# Altium schematic sheet MCU_F401RE.SchDoc
size A4; DocumentNumber: 4; SheetNumber: 4; SheetTotal: 5
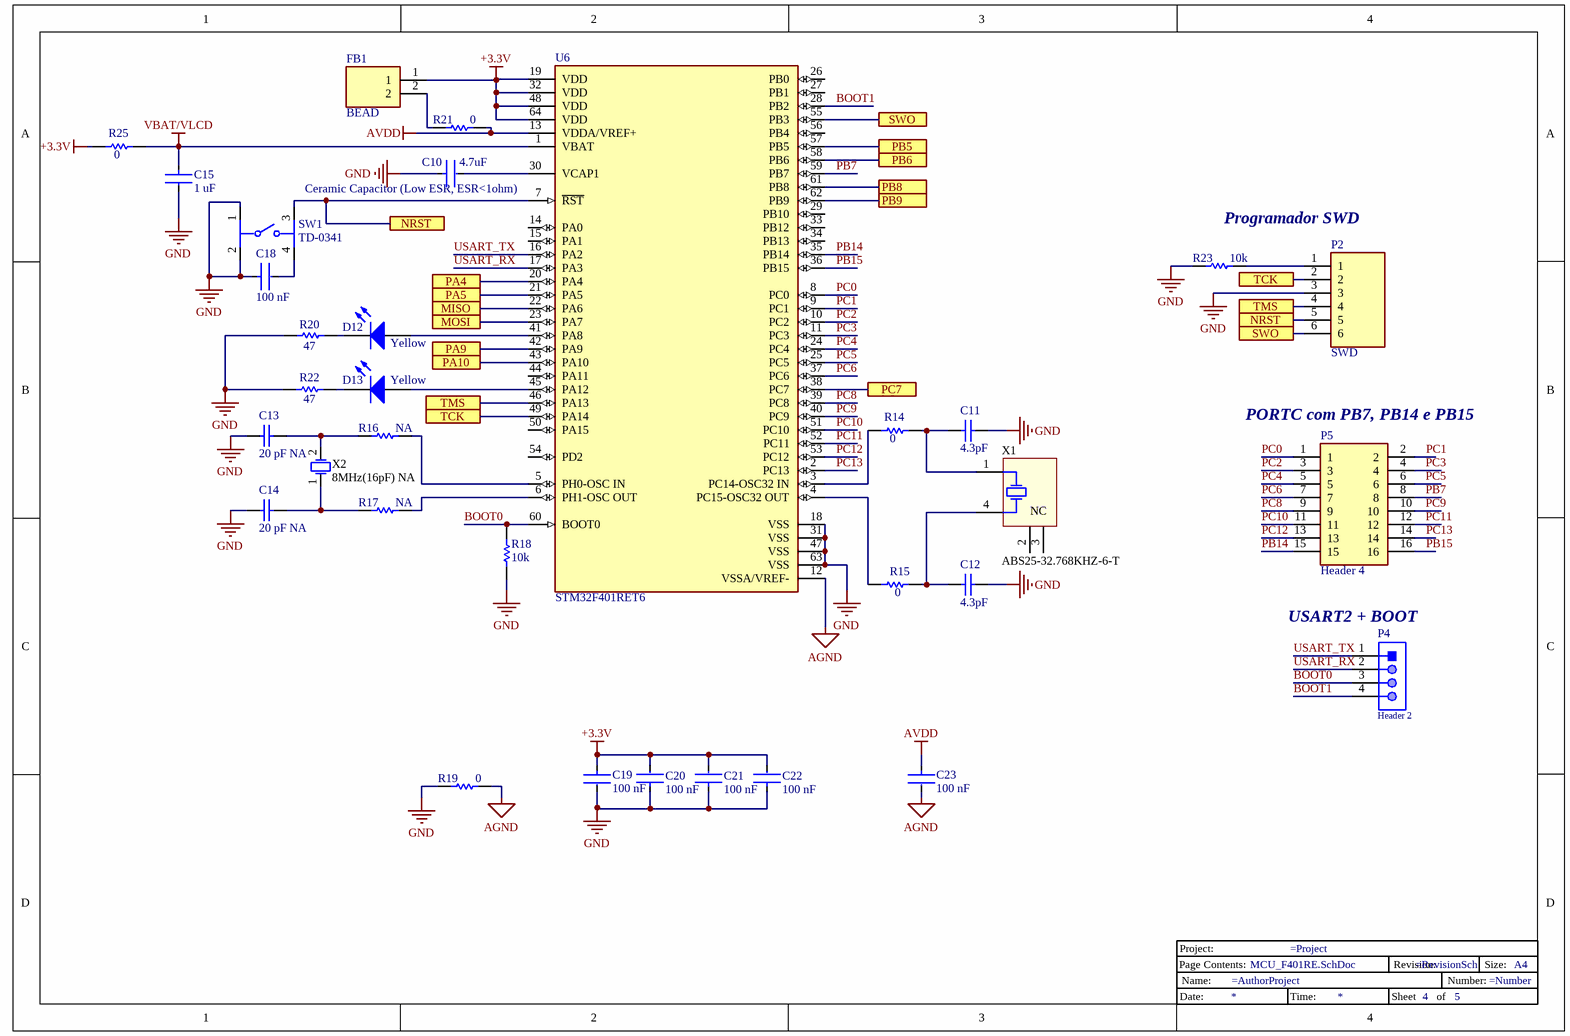
[diagram p0: MCU_F401RE.SchDoc]

## Parts
C10  4.7uF  [FP-GRT21B-0_15-IPC_B]
C11  4.3pF  [CAPC1608X90X35LL10T15]
C12  4.3pF  [CAPC1608X90X35LL10T15]
C13  20 pF NA  [CAPC1608X90X35NL15T15]
C14  20 pF NA  [CAPC1608X90X35NL15T15]
C15  1 uF  [FP-CC0603-DA-MFG]
C18  100 nF  [FP-CC0603-DA-MFG]
C19  100 nF  [FP-CC0603-DA-MFG]
C20  100 nF  [FP-CC0603-DA-MFG]
C21  100 nF  [FP-CC0603-DA-MFG]
C22  100 nF  [FP-CC0603-DA-MFG]
C23  100 nF  [FP-CC0603-DA-MFG]
D12  Yellow  [0805_A]
D13  Yellow  [0805_A]
FB1  BEAD  [BEADC1608X95N]
P2  SWD  [HDRV6W30P0X127_1X6_762X210X430P]
P4  Header 2  [61300411121]
P5  Header 4  [HDRV16W67P254_2X8_1991X488X821P]
R14  0  [RESC1608X55X25ML10T15]
R15  0  [RESC1608X55X25ML10T15]
R16  NA  [RESC1608X55X25ML10T15]
R17  NA  [RESC1608X55X25ML10T15]
R18  10k  [RESC1608X55X25ML10T15]
R19  0  [RESC1608X55X25ML10T15]
R20  47  [RESC1608X55X30NL20T20]
R21  0  [RESC1608X55X25ML10T15]
R22  47  [RESC1608X55X30NL20T20]
R23  10k  [RESC1608X55X25ML10T15]
R25  0  [RESC1608X55X25ML10T15]
SW1  TD-0341  [FP-1571563-9-MFG]
Title_Block_4  Title_Block  (value not drawn)
U6  STM32F401RET6  [FP-LQFP64-5W-MFG]
X1  ABS25-32.768KHZ-6-T  [ABRA-ABS25-4_V]
X2  8MHz(16pF) NA  [FOX-FOXSLF160-20]

## Ports
MISO, MOSI, NRST, PA4, PA5, PA9, PA10, PB5, PB6, PB8, PB9, PC7, SWO, TCK, TMS

## Nets
+3.3V: C19.1 C20.2 C21.2 C22.2 FB1.1 R25.1 U6.19(VDD) U6.32(VDD) U6.48(VDD) U6.64(VDD)
AGND: C23.2 R19.2 U6.12(VSSA/VREF-)
AVDD: C23.1 R21.2 U6.13(VDDA/VREF+)
GND: C10.1 C11.2 C12.2 C13.1 C14.1 C15.2 C18.1 C19.2 C20.1 C21.1 C22.1 P2.3 R18.1 R19.1 R20.2 R22.2 R23.1 SW1.1 SW1.2 U6.18(VSS) U6.31(VSS) U6.47(VSS) U6.63(VSS)
VBAT/VLCD: C15.1 R25.2 U6.1(VBAT)
BOOT0: P4.3 R18.2 U6.60(BOOT0)
BOOT1: P4.4 U6.28(PB2)
MISO: U6.22(PA6) ; port MISO
MOSI: U6.23(PA7) ; port MOSI
NRST: P2.5 SW1.3 U6.7(~{RST}) ; port NRST
PA4: U6.20(PA4) ; port PA4
PA5: U6.21(PA5) ; port PA5
PA9: U6.42(PA9) ; port PA9
PA10: U6.43(PA10) ; port PA10
PB5: U6.57(PB5) ; port PB5
PB6: U6.58(PB6) ; port PB6
PB7: P5.8 U6.59(PB7)
PB8: U6.61(PB8) ; port PB8
PB9: U6.62(PB9) ; port PB9
PB14: P5.15 U6.35(PB14)
PB15: P5.16 U6.36(PB15)
PC0: P5.1 U6.8(PC0)
PC1: P5.2 U6.9(PC1)
PC2: P5.3 U6.10(PC2)
PC3: P5.4 U6.11(PC3)
PC4: P5.5 U6.24(PC4)
PC5: P5.6 U6.25(PC5)
PC6: P5.7 U6.37(PC6)
PC7: U6.38(PC7) ; port PC7
PC8: P5.9 U6.39(PC8)
PC9: P5.10 U6.40(PC9)
PC10: P5.11 U6.51(PC10)
PC11: P5.12 U6.52(PC11)
PC12: P5.13 U6.53(PC12)
PC13: P5.14 U6.2(PC13)
SWO: P2.6 U6.55(PB3) ; port SWO
TCK: P2.2 U6.49(PA14) ; port TCK
TMS: P2.4 U6.46(PA13) ; port TMS
USART_RX: P4.2 U6.17(PA3)
USART_TX: P4.1 U6.16(PA2)
NetC10_2: C10.2 U6.30(VCAP1)
NetC11_1: C11.1 R14.2 X1.1(X1)
NetC12_1: C12.1 R15.2 X1.4(X2)
NetC13_2: C13.2 R16.1 X2.2
NetC14_2: C14.2 R17.1 X2.1
NetC18_2: C18.2 SW1.4
NetD12_1: D12.1(K) R20.1
NetD12_2: D12.2(A) U6.41(PA8)
NetD13_1: D13.1(K) R22.1
NetD13_2: D13.2(A) U6.45(PA12)
NetFB1_2: FB1.2 R21.1
NetP2_1: P2.1 R23.2
NetR14_1: R14.1 U6.3(PC14-OSC32_IN)
NetR15_1: R15.1 U6.4(PC15-OSC32_OUT)
NetR16_2: R16.2 U6.5(PH0-OSC_IN)
NetR17_2: R17.2 U6.6(PH1-OSC_OUT)

Not connected (* = marked no-connect by the designer): U6 14(PA0) 15(PA1) 26(PB0) 27(PB1) 29(PB10) 33(PB12) 34(PB13) 44(PA11) 50(PA15) 54(PD2) 56(PB4); X1 2(NC) 3(NC)

## Notes on the sheet
- (near C10) Ceramic Capacitor (Low ESR, ESR<1ohm)
- Programador SWD
- (near P5) PORTC com PB7, PB14 e PB15
- (near P4) USART2 + BOOT
- (in symbol Title_Block) Project:; Page Contents:; Revision:; Size:; A4; Name:; Number:; Date:; Time:; Sheet; of

## Library data of the parts
C10 = CMP-06035-019733-1: Cap Ceramic 4.7uF 50V X5R ±10% SMD 0805 +85°C Emboss T/R; Voltage Rating: 50V; Mount: Surface Mount; Ratings: AEC-Q200; Packaging: Tape and Reel; Width: 0.049inch; Case/Package: 0805; Max Operating Temperature: 85°C; Length: 0.079inch; Case Code (Imperial): 0805; Capacitance: 4.7uF; Thickness: 0.057inch; Min Operating Temperature: -55°C; Case Code (Metric): 2012; Dielectric: X5R; Tolerance: 10%; Voltage Rating (DC): 50V
C11 C12 = CMP-2006-02448-1: 0603; Part Number: GQM1885C2A4R3BB01D; Manufacturer: Murata
C13 C14 = CMP-2006-04264-1: Part Number: 06035A200JAT2A; Manufacturer: AVX Interconnect / Elco
C15 = CMP-1035-02737-2: CAP CER 1UF 16V X5R 0603; Manufacturer Part Number: CC0603KRX5R7BB105; Manufacturer: YAGEO; Material: Ceramic; Temperature Coefficient: 15%; Tolerance: 0.1; Digikey Description: CAP CER 1UF 16V X5R 0603; Category: Cap; Automotive: No; Octopart: https://octopart.com/cc0603krx5r7bb105-yageo-8376530; Voltage Rating: 16 V; Device Class L3: Ceramic Capacitors; Value: 1 uF; Temperature Characteristic: X5R; Voltage: 16 V; RoHS: TRUE; Lead Free: Yes; Temperature: -55°C to +125°C; Device Class L2: Capacitors; ComponentLink2URL: http://www.yageo.com/documents/recent/UPY-GPHC_X7R_6.3V-to-50V_18.pdf; Capacitance: 1 uF; Footprint Url: http://www.yageo.com/exep/pages/download/literatures/UPY-C_GEN_24.pdf; Height: 0.9mm; ComponentLink2Description: Datasheet; Temperature Range High: +125°C; Mouser Description: Multilayer Ceramic Capacitors MLCC - SMD/SMT 1.0uF 16V X5R 10%; Package: CC0603-DA; Device Class L1: Passive Components; Temperature Range Low: -55°C
C18-C23 = CMP-2100-03601-2: CAP CER 0.1UF 50V X7R 0603; Manufacturer: YAGEO; Manufacturer Part Number: CC0603KRX7R9BB104; Material: Ceramic; Temperature Coefficient: 15%; Tolerance: 0.1; Height: 0.9mm; Voltage: 50 V; ComponentLink2Description: Datasheet; Device Class L2: Capacitors; Temperature Range High: +125°C; Category: Cap; Capacitance: 100 nF; Footprint Url: http://www.yageo.com/exep/pages/download/literatures/UPY-C_GEN_24.pdf; ComponentLink2URL: http://www.yageo.com/documents/recent/UPY-GPHC_X7R_6.3V-to-50V_18.pdf; Package: CC0603-DA; Temperature: -55°C to +125°C; Voltage Rating: 50 V; Temperature Characteristic: X7R; Device Class L1: Passive Components; Temperature Range Low: -55°C; RoHS: TRUE; Automotive: No; Value: 100 nF; Device Class L3: Ceramic Capacitors; Octopart: https://octopart.com/cc0603krx7r9bb104-yageo-42244635; Mouser Description: Multilayer Ceramic Capacitor, CC Series, 0.1 - F, - 10%, X7R, 50 V, 0603 [1608 Metric]; Lead Free: Yes; Digikey Description: CAP CER 0.1UF 50V X7R 0603
D12 D13 = CMP-1426-00012-1: SMD mono-color Chip LED, WL-SMCW, Yellow; Manufacturer: Wuerth Elektronik; PartNumber: 150080YS75000; Color: Yellow; ComponentLink1URL: http://www.we-online.com; PackageReference: 0805_A; ComponentLink2URL: http://katalog.we-online.com/led/datasheet/150080YS75000.pdf; ComponentLink1Description: Manufacturer URL; ComponentLink2Description: Datasheet
FB1 = MMZ1608S601ATD25: Ferrite Bead; Manufacturer_Name: TDK; Datasheet Link: https://datasheet.datasheetarchive.com/originals/dk/DKDS-25/489214.pdf; Height: 0.95mm; Manufacturer_Part_Number: MMZ1608S601ATD25; Mouser Part Number: 810-MMZ1608S601ATD25; Mouser Price/Stock: https://www.mouser.co.uk/ProductDetail/TDK/MMZ1608S601ATD25?qs=pvNC7ksEVIeMnkuqWHgErw%3D%3D; Arrow Part Number: MMZ1608S601ATD25; Arrow Price/Stock: https://www.arrow.com/en/products/mmz1608s601atd25/tdk
P2 = M50-3530642: Connector; Manufacturer_Name: Harwin; Datasheet Link: https://cdn.harwin.com/pdfs/M50-353.pdf; Height: 4.3mm; Manufacturer_Part_Number: M50-3530642; Mouser Part Number: 855-M50-3530642; Mouser Price/Stock: https://www.mouser.co.uk/ProductDetail/Harwin/M50-3530642?qs=%252BdQmOuGyFcHPs2UJx%2F79Cg%3D%3D
P4 = CMP-1502-01064-1: THT Vertical Pin Header WR-PHD, Pitch 2.54 mm, Single Row, 4 pins; Manufacturer: Wurth Elektronik; Withstanding Voltage: 500VAC; Rated Current: 3A; Working Voltage: 250VAC; Pin Number: 4; Gender: Male; Contact Resistance: 20mOhm; Pitch: 2.54mm; Manufacturer URL: http://www.we-online.de; Operating Temperature: -40to105degC; Packaging: Bag; Mounting Technology: THT; Package Reference: 61300411121; Datasheet URL: https://katalog.we-online.de/em/datasheet/6130xx11121.pdf; Publisher: WurthElektronik; Part Number: 61300411121; Row Number: Single; Orientation: Vertical
P5 = 5-146254-8: Connector; Manufacturer_Name: TE Connectivity; Datasheet Link: https://www.te.com/commerce/DocumentDelivery/DDEController?Action=srchrtrv&DocNm=146254&DocType=Customer+Drawing&DocLang=English; Height: 8.21mm; Manufacturer_Part_Number: 5-146254-8; Mouser Part Number: 571-5-146254-8; Mouser Price/Stock: https://www.mouser.co.uk/ProductDetail/TE-Connectivity/5-146254-8?qs=bwpFY26eRVeR6qljXzz%2FRg%3D%3D; Arrow Part Number: 5-146254-8; Arrow Price/Stock: https://www.arrow.com/en/products/5-146254-8/te-connectivity
R14-R17 R19 R21 R25 = CMP-2100-03667-1: Chip Resistor, 0 Ohm, +/- 5%, 0.1 W, -55 to 155 degC, 0603 (1608 Metric), RoHS, Tape and Reel; Manufacturer: Yageo; Temperature Coefficient: 200ppm/degreesC; Voltage Rating: 50V; Power Rating: 100mW; Resistance: 0mOhm; Width: 0.8mm; Max Operating Temperature: 155degC; Tolerance: 5%; Package Reference: 0603; Height: 0.45mm; Depth: 0.8mm; Package Description: 2-Pin Surface Mount Device, Body 1.6 x 0.8 mm; Termination: SMD/SMT; Package Quantity: 5000; Case/Package: 0603; Case Code (Imperial): 0603; Radiation Hardening: No; Number of Pins: 2; Length: 1.6mm; Lead Free: LeadFree; Voltage Rating (DC): 50V; Military Standard: Not; Datasheet URL: http://www.yageo.com/NewPortal/yageodocoutput?fileName=/pdf/R-Chip/PYu-RC_Group_51_RoHS_L_5.pdf; Manufacturer URL: http://www.yageo.com/; Packaging: TapeandReel; Case Code (Metric): 1608; Min Operating Temperature: -55degC; Composition: ThickFilm; RoHSCompliant: true; Contact Plating: Tin; Datasheet Version: Rev. 5, 10/2016; REACH SVHC: NoSVHC
R18 R23 = CMP-2000-05022-1: Resistor, 10 kOhm, +/- 5%, 100 mW, -55 to 155 degC, 0603 (1608 Metric), RoHS, Tape and Reel; Manufacturer: Yageo; Resistance: 10kOhms; Voltage Rating: 50V; Temperature Coefficient: 100PPM/C; Power Rating: 100mW; Package Reference: 603; Series: RC; Case Code - mm: 1608; Packaging: Reel; Datasheet URL: http://www.farnell.com/datasheets/443971.pdf; Datasheet Version: Rev. 4, 04/2009; Operating Temperature Range: -55Cto+155C; Product: ThickFilmResistorsGeneralPurpose; Package Description: 2-Pin Surface Mount Device, Body 1.6 x 0.8 mm; Manufacturer URL: http://www.yageo.com/; Case Code - in: 0603; Tolerance: 5%; Termination Style: SMD/SMT
R20 R22 = CMP-2000-00070-1: Part Number: ERA3AEB470V; Manufacturer: Panasonic
SW1 = CMP-03402-000005-1: SWITCH TACTILE SPST-NO 0.05A 24V; Manufacturer: TE Connectivity; Manufacturer Part Number: 1571563-9; Standoff Height: 0.05mm; Electromechanical Life: 100000Cycles; Contact Resistance: 100mΩ; Operating Force: 160gf; Contact Current Rating: 50mA; Automotive: No; Device Class L1: Electromechanical; Voltage Rating Dc: 24V; ComponentLink2Description: Datasheet; Mount: Surface Mount; RoHS: TRUE; Temperature: -35°C to +85°C; ComponentLink2URL: https://www.te.com/commerce/DocumentDelivery/DDEController?Action=showdoc&DocId=Customer+Drawing%7F2-1437565-7%7FV%7Fpdf%7FEnglish%7FENG_CD_2-1437565-7_V.pdf%7F1571563-9; Temperature Range Low: -35°C; Lead Free: Yes; Device Class L2: Switches; Package: SMT_SW_6MM0_6MM0; Octopart: https://octopart.com/1571563-9-te+connectivity-41253969; Throw Configuration: SPST-NO; Mouser Description: Tactile Switches SPST OFF(ON) RND SMT MINI PB TACT SWITCH; Temperature Range High: +85°C; Digikey Description: SWITCH TACTILE SPST-NO 0.05A 24V; Device Class L3: Pushbutton Switches; Category: Switch; Height: 9.75mm
U6 = CMP-12105-000004-1: IC MCU 32BIT 512KB FLASH 64LQFP; Manufacturer: STMicroelectronics; Memory Size: 512KBytes; Number Of Cores: 1; Max Junction Temp: +105°C; Ram Size: 96KBytes; Number Of Adc Channels: 12; Number Of Pwm Channels: 23; Standoff Height: 0.05mm; Frequency: 84MHz; Number Of Timers/Counters: 8; Number Of I/Os: 50; Interface: I2C,SPI,USART,USB,IrDA,I2S,SMBus,Other; Number Of I2C Channels: 3; Max Supply Voltage: 3.6V; Data Bus Width: 32bits; Core Architecture: ARM Cortex-M4; Min Supply Voltage: 1.65V; Category: IC; Device Class L3: Microcontrollers; ComponentLink2URL: https://www.st.com/resource/en/datasheet/stm32f401re.pdf; RoHS: TRUE; Temperature Range High: +105°C; Device Class L2: Embedded Processors and Controllers; ComponentLink2Description: Datasheet; Temperature Range Low: -40°C; Digikey Description: IC MCU 32BIT 512KB FLASH 64LQFP; Package: LQFP64-5W; Manufacturer Part Number: STM32F401RET6; Number Of A/D Converters: 1; Ipc Land Pattern Name: QFP50P1200X1200X160-64; Automotive: No; Ambient Temperature Range Low: -40°C; Height: 1.6mm; Octopart: https://octopart.com/stm32f401ret6-stmicroelectronics-34185993; Ambient Temperature Range High: +85°C; Device Class L1: Integrated Circuits (ICs); Temperature: -40°C to +105°C; Number Of Spi Channels: 3; Number Of Uart Channels: 3; Memory Type: FLASH; Number Of Usb Channels: 1; Lead Free: Yes; Mouser Description: ARM Microcontrollers - MCU 16/32-BITS MICROS
X1 = CMP-2000-05036-1: Low Frequency Crystal, 32.768 KHz, 6 pF, +/- 20 ppm, -40 to 85 degC, 4-Pin SMD, RoHS, Tape and Reel; Manufacturer: Abracon; Tolerance: 20PPM; ESR: 50kOhms; Case Width: 3.8mm; Case Height: 2.5mm; Case Length: 8mm; Load Capacitance: 6pF; Operating Temperature Range: -40Cto+85C; Package Reference: ABS25; Factory Pack Quantity: 3000; Package Description: 4-Pin Surface Mount Device, Body 8 x 3.8 mm, Pitch 5.5 mm; Frequency: 32.768kHz; Termination Style: SMD/SMT; Manufacturer URL: http://www.abracon.com/; Type: LowFrequencyCrystal; Dimensions: 3.8mmWx8mmLx2.5mmH; Product Category: Crystals; Series: ABS25; RoHS: Details; Package / Case: 8mmx3.8mm; Datasheet Version: Jun-17; Brand: ABRACON; Datasheet URL: https://datasheet.ciiva.com/854/abs25-854528.pdf; Packaging: Reel; Mounting Style: SMD/SMT
X2 = CMP-1749-00003-1: Resistance Weld Thru-Hole Crystal, 16 MHz, -20 to 70 degC, 2-Pin THD, RoHS, Bulk; Voltage Rating: 250 V; Tolerance: 1%; Resistance: 221 kohm; Case\Package: Axial; Power Rating: 250 mW; RoHSCompliant: true; Package Quantity: 200; Packaging: Bulk; Min Operating Temperature: -55 degC; DatasheetVersion: Mar-15; ComponentLink1URL: http://www.foxonline.com/; Max Operating Temperature: 155 degC; PackageReference: FOXSLF160-20; Mount: Through Hole; PackageDescription: 2-Pin Through Hole Device, Body 11.35 x 4.65 mm; ComponentLink1Description: Manufacturer URL; ComponentLink2URL: http://www.foxonline.com/pdfs/hc49slf.pdf; ComponentLink2Description: Datasheet; Length: 0.248 inch